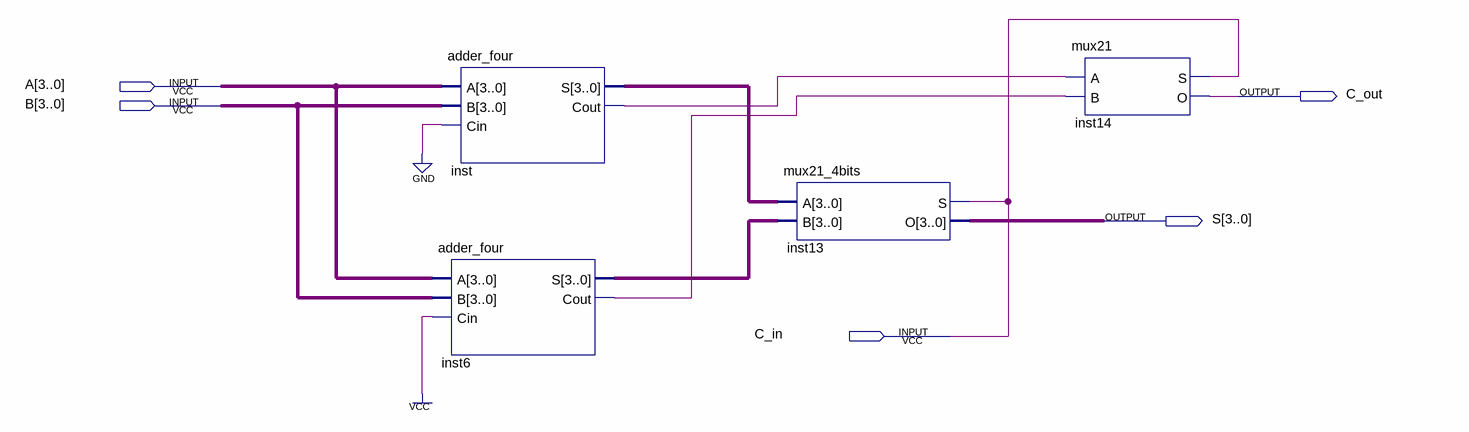
[diagram p0: schematic sheet]
// Quartus schematic adder_four_ins.bdf as structural Verilog: 4 symbols, 5 pins
module adder_four_ins (
  input  [3:0] A,
  input  [3:0] B,
  input  C_in,
  output C_out,
  output [3:0] S
);

  wire inst6_cout, inst_cout;
  wire [3:0] inst6_s, inst_s;

  adder_four inst (.A(A), .B(B), .Cin(1'b0), .S(inst_s), .Cout(inst_cout));
  adder_four inst6 (.A(A), .B(B), .Cin(1'b1), .S(inst6_s), .Cout(inst6_cout));
  mux21_4bits inst13 (.A(inst_s), .B(inst6_s), .O(S), .S(C_in));
  mux21 inst14 (.A(inst_cout), .B(inst6_cout), .O(C_out), .S(C_in));
endmodule
